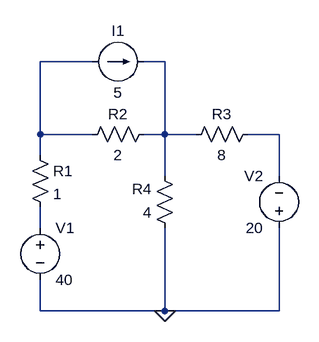
[diagram p0: schematic Draft20.asc]
Draft20.asc, the LTspice schematic file:
Version 4
SHEET 1 880 680
WIRE 160 -32 80 -32
WIRE 272 -32 240 -32
WIRE 80 80 80 -32
WIRE 160 80 80 80
WIRE 272 80 272 -32
WIRE 272 80 240 80
WIRE 320 80 272 80
WIRE 448 80 400 80
WIRE 80 112 80 80
WIRE 272 144 272 80
WIRE 448 144 448 80
WIRE 80 224 80 192
WIRE 80 352 80 304
WIRE 272 352 272 224
WIRE 272 352 80 352
WIRE 448 352 448 224
WIRE 448 352 272 352
FLAG 272 352 0
SYMBOL voltage 80 208 R0
SYMATTR InstName V1
SYMATTR Value 40
SYMBOL res 64 96 R0
SYMATTR InstName R1
SYMATTR Value 1
SYMBOL res 256 64 R90
WINDOW 0 0 56 VBottom 2
WINDOW 3 32 56 VTop 2
SYMATTR InstName R2
SYMATTR Value 2
SYMBOL res 416 64 R90
WINDOW 0 0 56 VBottom 2
WINDOW 3 32 56 VTop 2
SYMATTR InstName R3
SYMATTR Value 8
SYMBOL res 288 240 R180
WINDOW 0 36 76 Left 2
WINDOW 3 36 40 Left 2
SYMATTR InstName R4
SYMATTR Value 4
SYMBOL voltage 448 240 R180
WINDOW 0 24 96 Left 2
WINDOW 3 24 16 Left 2
SYMATTR InstName V2
SYMATTR Value 20
SYMBOL current 160 -32 R270
WINDOW 0 32 40 VTop 2
WINDOW 3 -32 40 VBottom 2
SYMATTR InstName I1
SYMATTR Value 5

The netlist it stands for:
* Draft20.asc
V1 N004 0 40
R1 N001 N004 1
R2 N002 N001 2
R3 N003 N002 8
R4 0 N002 4
V2 0 N003 20
I1 N001 N002 5
.backanno
.end